# Altium schematic sheet CAN_circuit.SchDoc
size A
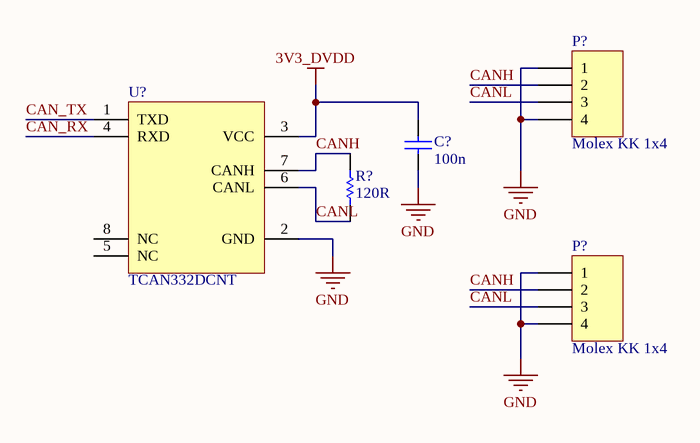
[diagram p0: CAN_circuit.SchDoc]

## Parts
(Parts that share a designator on the sheet are numbered #1, #2 ... from top to bottom, then left to right.)
C?  100n  [C0805]
P?#1  Molex KK 1x4  [Molex KK 4x1]
P?#2  Molex KK 1x4  [Molex KK 4x1]
R?  120R  [R0805]
U?  TCAN332DCNT  [SOT-23-8]

## Nets
3V3_DVDD: C?.1 U?.3(VCC)
GND: C?.2 P?#1.1 P?#1.4 P?#2.1 P?#2.4 U?.2(GND)
CAN_RX: U?.4(RXD)
CAN_TX: U?.1(TXD)
CANH: P?#1.2 P?#2.2 R?.2 U?.7(CANH)
CANL: P?#1.3 P?#2.3 R?.1 U?.6(CANL)

Not connected (* = marked no-connect by the designer): U? 5(NC) 8(NC)

## Library data of the parts
C? = C0805: 0805 Capacitor; Value: 100n
P?#1 P?#2 = Molex KK 1x4: 1x4 Molex KK Connector
R? = R0805: RESISTOR 0805; Value: 120R
U? = TCAN332DCNT: IC TXRX CAN 3.3V SOT23-8